# Altium schematic sheet SDCard.SchDoc: Evaluation Board 3.2
size A3; Organization: Toradex AG; Address1: Altsagenstrasse 5; Address2: Horw; Address3: 6048; Address4: Switzerland; DocumentNumber: 7; Revision: V3.2; SheetNumber: 7; SheetTotal: 23; PageSetup: Record=PageOptions|CenterHorizontal=True|CenterVertical=True|PrintScale=0.73|XCorrection=1.00|YCorrection=1.00|PrintKind=0|BorderSize=5000000|LeftOffset=0|BottomOffset=0|Orientation=2|PaperLength=1000|PaperWidth=1000|Scale=100|PaperSource=7|PrintQuality=-4|MediaType=1|DitherType=10|PaperKind=A4|PrintScaleMode=1
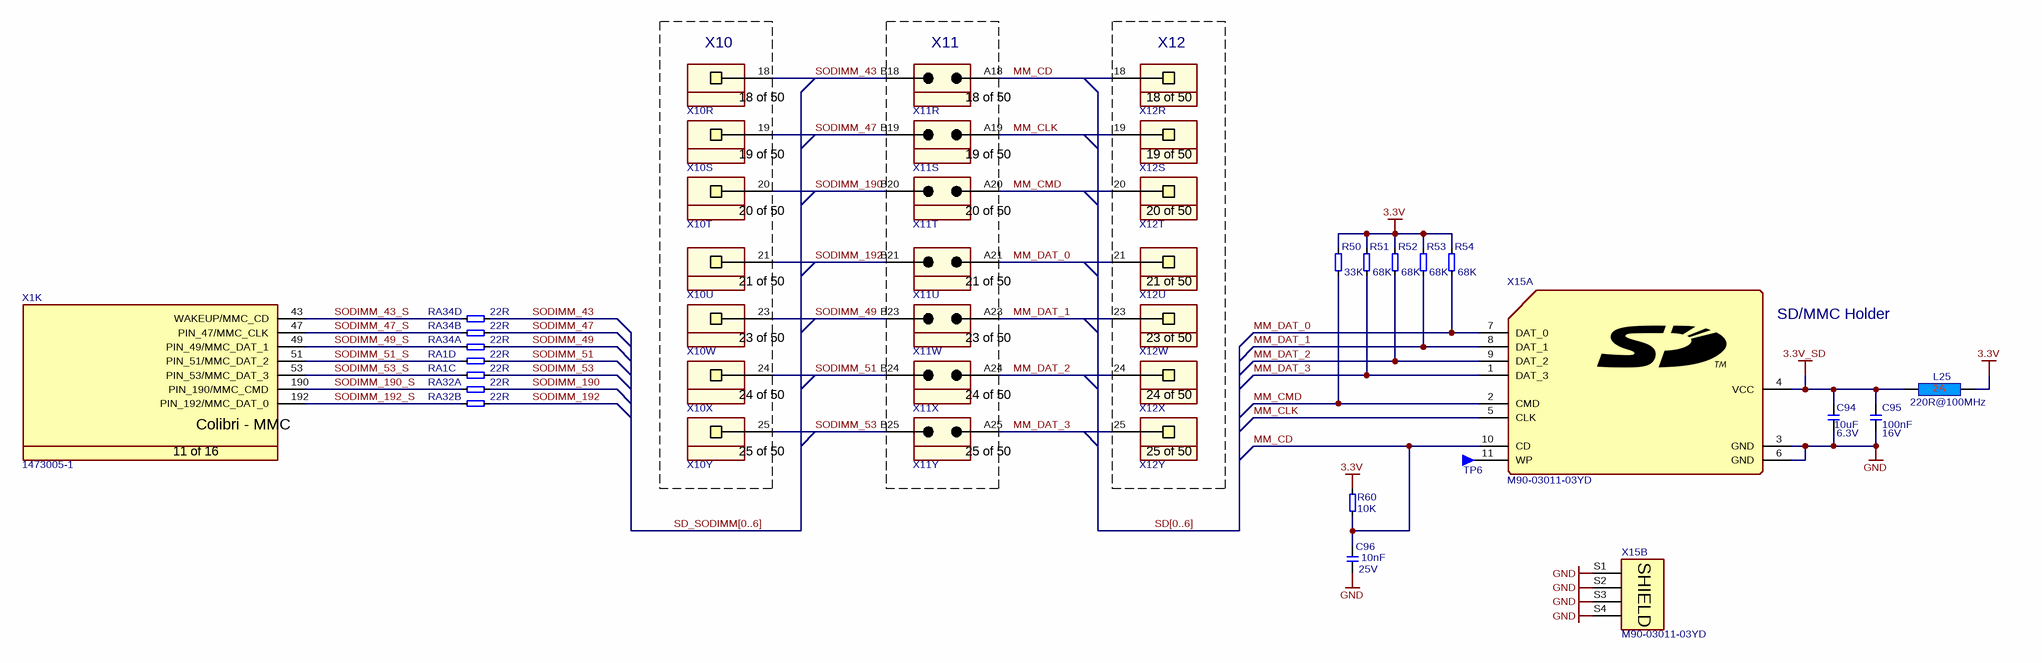
[diagram p0: SDCard.SchDoc]

## Parts
C94  Rating: 6.3V  [T_CAPC0603X33N]  (hidden comment: 10uF)
C95  Rating: 16V  [T_CAPC0603X33N]  (hidden comment: 100nF)
C96  Rating: 25V  [T_CAPC0603X33N]  (hidden comment: 10nF)
L25  220R@100MHz  [INDC1608X95N]
R50  33K  [T_RESC0603X30N]
R51  68K  [T_RESC0603X30N]
R52  68K  [T_RESC0603X30N]
R53  68K  [T_RESC0603X30N]
R54  68K  [T_RESC0603X30N]
R60  10K  [T_RESC0603X30N]
RA1  22R  [T_Resistor_Array_X4]  (parts C,D of 4)
RA32  22R  [T_Resistor_Array_X4]  (parts A,B of 4)
RA34  22R  [T_Resistor_Array_X4]  (parts A,B,D of 4)
TP6  Testpin  [T_TP-THT]  (value not drawn)
X1  Manufacturer Part No.: 1473005-1  [T_Tyco_1473005-1]  (hidden comment: CON-Tyco-1473005-1-200-0.6mm)  (part K of 16)
X10  SSW-110-01-G-S  [T_Samtec_SSW-110-01-G-S]  (value not drawn)  (parts R,S,T,U,W,X,Y of 50)
X11  TSW-110-07-G-D  [T_Samtec_TSW-110-07-G-D]  (value not drawn)  (parts R,S,T,U,W,X,Y of 50)
X12  SSW-110-01-G-S  [T_Samtec_SSW-110-01-G-S]  (value not drawn)  (parts R,S,T,U,W,X,Y of 50)
X15  Manufacturer Part No.: M90-03011-03YD  [T_ AMPHENOL_101-00708-64]  (hidden comment: MicroSD Holder)  (parts A,B of 2)

## Blocks framed on the sheet
X10: X10
X11: X11
X12: X12

## Nets
3.3V: L25.2 R50.2 R51.2 R52.2 R53.2 R54.2 R60.2
3.3V_SD: C94.2 C95.2 L25.1 X15.4(VCC)
GND: C94.1 C95.1 C96.1 X15.3(GND) X15.6(GND) X15.S1(S) X15.S2(S) X15.S3(S) X15.S4(S)
MM_CD: C96.2 R60.1 X11.A18 X12.18 X15.10(CD)
MM_CLK: X11.A19 X12.19 X15.5(CLK)
MM_CMD: R50.1 X11.A20 X12.20 X15.2(CMD)
MM_DAT_0: R54.1 X11.A21 X12.21 X15.7(DAT_0)
MM_DAT_1: R53.1 X11.A23 X12.23 X15.8(DAT_1)
MM_DAT_2: R52.1 X11.A24 X12.24 X15.9(DAT_2)
MM_DAT_3: R51.1 X11.A25 X12.25 X15.1(DAT_3)
SODIMM_43: RA34.8 X10.18 X11.B18
SODIMM_43_S: RA34.4 X1.43(WAKEUP/MMC_CD)
SODIMM_47: RA34.6 X10.19 X11.B19
SODIMM_47_S: RA34.2 X1.47(PIN_47/MMC_CLK)
SODIMM_49: RA34.5 X10.23 X11.B23
SODIMM_49_S: RA34.1 X1.49(PIN_49/MMC_DAT_1)
SODIMM_51: RA1.8 X10.24 X11.B24
SODIMM_51_S: RA1.4 X1.51(PIN_51/MMC_DAT_2)
SODIMM_53: RA1.7 X10.25 X11.B25
SODIMM_53_S: RA1.3 X1.53(PIN_53/MMC_DAT_3)
SODIMM_190: RA32.5 X10.20 X11.B20
SODIMM_190_S: RA32.1 X1.190(PIN_190/MMC_CMD)
SODIMM_192: RA32.6 X10.21 X11.B21
SODIMM_192_S: RA32.2 X1.192(PIN_192/MMC_DAT_0)
NetTP6_1: TP6.1 X15.11(WP)

## Buses and harness runs
bus SD[0..6]
bus SD_SODIMM[0..6]

## Notes on the sheet
- (near X15) SD/MMC Holder
- Title
- Size:
- Date:
- A3
- Number:
- Time:
- Revision:
- Sheet
- of
- File:
- (in symbol CON-Cenlink-M90-03011-03YD, part B) SHIELD
- (in symbol CON-Samtec-SSW-110-01-G-S, part R) 18 of 50
- (in symbol CON-Samtec-SSW-110-01-G-S, part S) 19 of 50
- (in symbol CON-Samtec-SSW-110-01-G-S, part T) 20 of 50
- (in symbol CON-Samtec-SSW-110-01-G-S, part U) 21 of 50
- (in symbol CON-Samtec-SSW-110-01-G-S, part W) 23 of 50
- (in symbol CON-Samtec-SSW-110-01-G-S, part X) 24 of 50
- (in symbol CON-Samtec-SSW-110-01-G-S, part Y) 25 of 50
- (in symbol CON-Samtec-TSW-110-07-G-D, part R) 18 of 50
- (in symbol CON-Samtec-TSW-110-07-G-D, part S) 19 of 50
- (in symbol CON-Samtec-TSW-110-07-G-D, part T) 20 of 50
- (in symbol CON-Samtec-TSW-110-07-G-D, part U) 21 of 50
- (in symbol CON-Samtec-TSW-110-07-G-D, part W) 23 of 50
- (in symbol CON-Samtec-TSW-110-07-G-D, part X) 24 of 50
- (in symbol CON-Samtec-TSW-110-07-G-D, part Y) 25 of 50
- (in symbol CON-Tyco-1473005-1-200-0.6mm, part K) Colibri - MMC; 11 of 16

## Library data of the parts
C94 = C-X5R-10uF-6.3V-20%-0603: Capacitor Ceramic X5R 10uF 6.3V 20% 0603; Tolerance: 20%; Type: X5R; Value: 10uF
C95 = C-X7R-100nF-16V-10%-0603: Capacitor Ceramic X7R 100nF 16V 10% 0603; Tolerance: 10%; Type: X7R; Value: 100nF
C96 = C-X7R-10nF-25V-10%-0603: Capacitor Ceramic X7R 10nF 25V 10% 0603; Tolerance: 10%; Type: X7R; Value: 10nF
L25 = L-220R@100MHz-2A-25%-0603: 220R@100MHz 2A EMI FILTER; Tolerance: 25%; Rating: 2A; Value: 220R@100MHz
R50 = R-33KR-63mW-5%-0603: Resistor 33 Kohm 63mW 5% 0603; Value: 33KR; Rating: 63mW; Tolerance: 5%
R51-R54 = R-68KR-63mW-5%-0603: Resistor 68 Kohm 63mW 5% 0603; Value: 68KR; Rating: 63mW; Tolerance: 5%
R60 = R-10KR-63mW-5%-0603: Resistor 10 Kohm 63mW 5% 0603; Value: 10KR; Rating: 63mW; Tolerance: 5%
RA1 RA32 RA34 = RA-22R-63mW-5%-1206-div: Resistor Array 22 R 63mW 5% 1206; Tolerance: 5%; Power Dissipation: 63mW; Value: 22R
TP6 = Testpin: Testpin TH
X1 = CON-Tyco-1473005-1-200-0.6mm: SODIMM Connector; Manufacturer Name: Tyco; No. of ways: 200
X10 X12 = CON-Samtec-SSW-110-01-G-S: Header 1x50 pin 2.54mm pitch; Manufacturer Name: Samtec; Pitch: 2.54mm; No. of ways: 1x50; Manufacturer Part No.: SSW-110-01-G-S
X11 = CON-Samtec-TSW-110-07-G-D: Header 2x50 pin 2.54mm pitch; Manufacturer Name: Samtec; Pitch: 2.54mm; No. of ways: 2x50; Manufacturer Part No.: TSW-110-07-G-D
X15 = CON-Cenlink-M90-03011-03YD: SD/MMC Card Holder; No. of ways: 9+2; Manufacturer Name: Cenlink